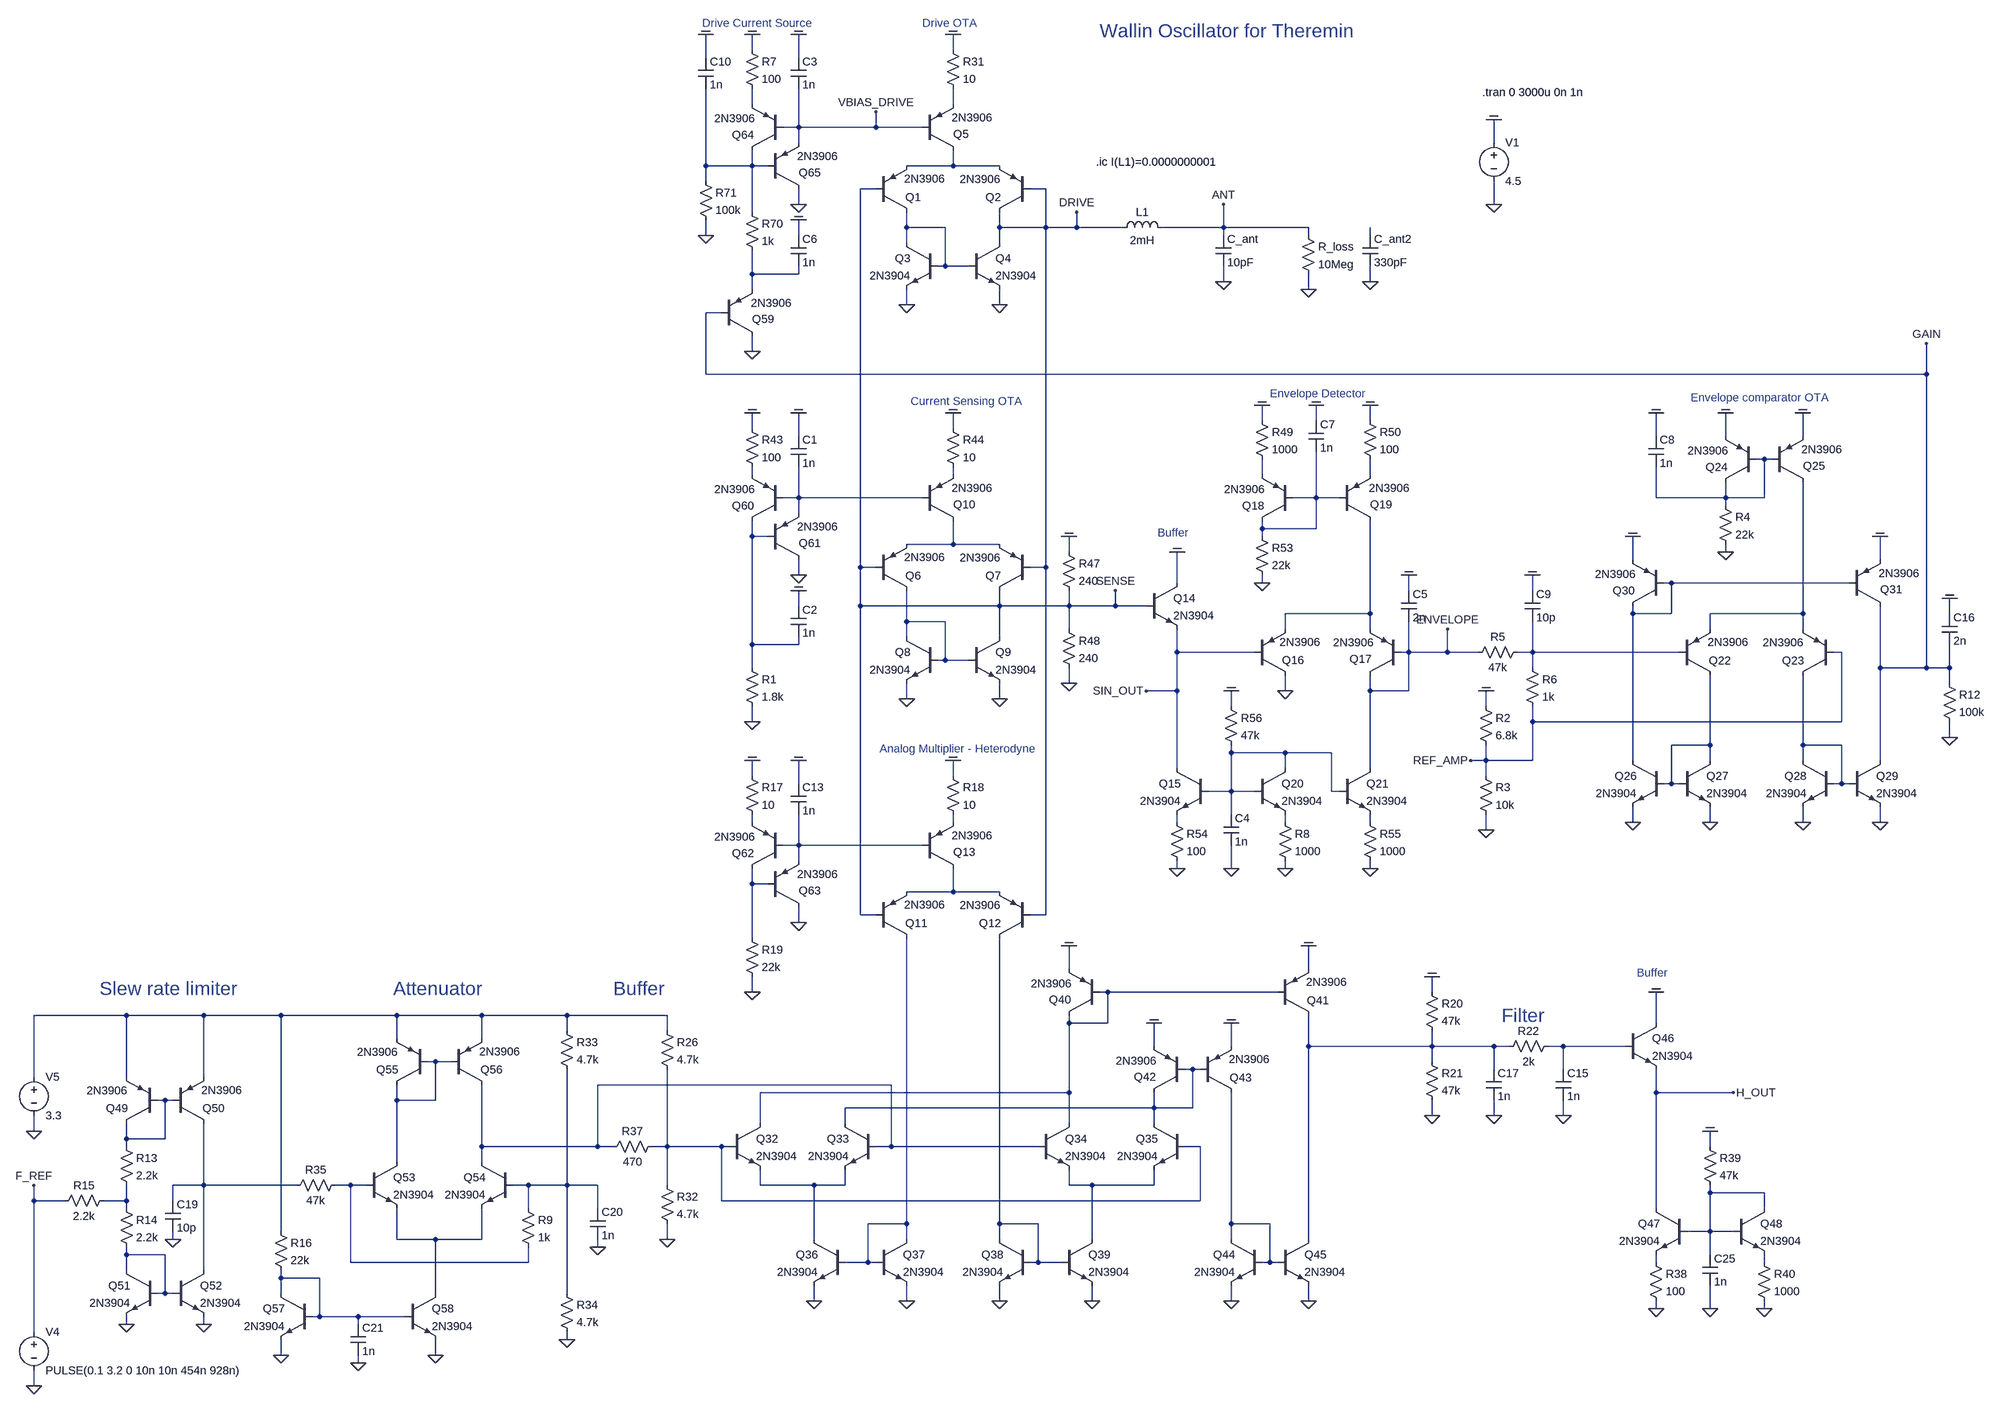
[diagram p0: schematic current_sensing_osc_v14.asc]
current_sensing_osc_v14.asc, the LTspice schematic file:
Version 4
SHEET 1 20072 11696
WIRE 15840 8208 15840 8176
WIRE 16256 8208 16256 8176
WIRE 15744 8224 15744 8176
WIRE 15936 8224 15936 8176
WIRE 15840 8320 15840 8288
WIRE 16256 8320 16256 8288
WIRE 15936 8368 15936 8288
WIRE 15936 8368 15904 8368
WIRE 16096 8368 16096 8336
WIRE 16096 8368 15936 8368
WIRE 16192 8368 16096 8368
WIRE 15936 8400 15936 8368
WIRE 17376 8400 17376 8352
WIRE 15744 8448 15744 8288
WIRE 15840 8448 15840 8416
WIRE 15840 8448 15744 8448
WIRE 15872 8448 15840 8448
WIRE 16256 8448 16256 8416
WIRE 16256 8448 16160 8448
WIRE 16352 8448 16256 8448
WIRE 15744 8480 15744 8448
WIRE 16096 8496 16064 8496
WIRE 16448 8496 16416 8496
WIRE 15936 8528 15936 8496
WIRE 17376 8528 17376 8480
WIRE 15840 8544 15840 8448
WIRE 16160 8576 16160 8544
WIRE 16240 8576 16160 8576
WIRE 16352 8576 16352 8544
WIRE 16448 8576 16448 8496
WIRE 16448 8576 16352 8576
WIRE 16512 8576 16512 8544
WIRE 16512 8576 16448 8576
WIRE 16608 8576 16512 8576
WIRE 16816 8576 16816 8528
WIRE 16816 8576 16688 8576
WIRE 16992 8576 16816 8576
WIRE 15744 8592 15744 8560
WIRE 15936 8592 15936 8560
WIRE 16816 8592 16816 8576
WIRE 16992 8592 16992 8576
WIRE 17120 8592 17120 8576
WIRE 16160 8608 16160 8576
WIRE 16352 8608 16352 8576
WIRE 16240 8656 16240 8576
WIRE 16240 8656 16224 8656
WIRE 16288 8656 16240 8656
WIRE 15840 8672 15840 8624
WIRE 15936 8672 15936 8656
WIRE 15936 8672 15840 8672
WIRE 16816 8688 16816 8656
WIRE 17120 8688 17120 8656
WIRE 15840 8704 15840 8672
WIRE 16992 8704 16992 8672
WIRE 16160 8736 16160 8704
WIRE 16352 8736 16352 8704
WIRE 15776 8752 15744 8752
WIRE 15840 8832 15840 8800
WIRE 15744 8880 15744 8752
WIRE 18272 8880 18272 8816
WIRE 18272 8880 15744 8880
WIRE 16896 8976 16896 8944
WIRE 17008 8976 17008 8944
WIRE 17120 8976 17120 8944
WIRE 15840 8992 15840 8960
WIRE 16256 8992 16256 8960
WIRE 15936 9008 15936 8960
WIRE 17712 9008 17712 8960
WIRE 17856 9008 17856 8960
WIRE 18016 9008 18016 8960
WIRE 17936 9056 17920 9056
WIRE 17952 9056 17936 9056
WIRE 15840 9088 15840 9072
WIRE 16256 9088 16256 9072
WIRE 16896 9088 16896 9056
WIRE 17120 9088 17120 9056
WIRE 15936 9136 15936 9072
WIRE 15936 9136 15904 9136
WIRE 16192 9136 15936 9136
WIRE 17008 9136 17008 9040
WIRE 17008 9136 16960 9136
WIRE 17056 9136 17008 9136
WIRE 17712 9136 17712 9072
WIRE 17856 9136 17856 9104
WIRE 17856 9136 17712 9136
WIRE 17936 9136 17936 9056
WIRE 17936 9136 17856 9136
WIRE 17856 9152 17856 9136
WIRE 15936 9168 15936 9136
WIRE 16896 9200 16896 9184
WIRE 17008 9200 17008 9136
WIRE 17008 9200 16896 9200
WIRE 15840 9216 15840 9184
WIRE 15872 9216 15840 9216
WIRE 16896 9216 16896 9200
WIRE 16256 9232 16256 9184
WIRE 16256 9232 16160 9232
WIRE 16352 9232 16256 9232
WIRE 16496 9248 16496 9216
WIRE 17856 9248 17856 9232
WIRE 17664 9264 17664 9216
WIRE 18176 9264 18176 9216
WIRE 16064 9280 16064 8496
WIRE 16096 9280 16064 9280
WIRE 16448 9280 16448 8576
WIRE 16448 9280 16416 9280
WIRE 15936 9296 15936 9264
WIRE 16720 9312 16720 9248
WIRE 16896 9312 16896 9296
WIRE 17744 9312 17728 9312
WIRE 18112 9312 17744 9312
WIRE 17200 9328 17200 9296
WIRE 17456 9328 17456 9296
WIRE 15936 9360 15936 9328
WIRE 16064 9360 16064 9280
WIRE 16352 9360 16352 9328
WIRE 16352 9360 16064 9360
WIRE 16496 9360 16496 9328
WIRE 16496 9360 16352 9360
WIRE 16592 9360 16592 9328
WIRE 16592 9360 16496 9360
WIRE 16656 9360 16592 9360
WIRE 17120 9376 17120 9184
WIRE 17120 9376 16944 9376
WIRE 17664 9376 17664 9360
WIRE 17744 9376 17744 9312
WIRE 17744 9376 17664 9376
WIRE 18016 9376 18016 9104
WIRE 18016 9376 17824 9376
WIRE 18320 9376 18320 9344
WIRE 16160 9392 16160 9328
WIRE 16240 9392 16160 9392
WIRE 16496 9408 16496 9360
WIRE 16944 9408 16944 9376
WIRE 17120 9408 17120 9376
WIRE 17824 9408 17824 9376
WIRE 18016 9408 18016 9376
WIRE 16160 9424 16160 9392
WIRE 16352 9424 16352 9360
WIRE 15840 9440 15840 9216
WIRE 15936 9440 15936 9424
WIRE 15936 9440 15840 9440
WIRE 16720 9456 16720 9408
WIRE 16880 9456 16720 9456
WIRE 17200 9456 17200 9392
WIRE 17200 9456 17184 9456
WIRE 17280 9456 17280 9408
WIRE 17280 9456 17200 9456
WIRE 17344 9456 17280 9456
WIRE 17456 9456 17456 9392
WIRE 17456 9456 17424 9456
WIRE 17760 9456 17456 9456
WIRE 18096 9456 18080 9456
WIRE 16240 9472 16240 9392
WIRE 16240 9472 16224 9472
WIRE 16288 9472 16240 9472
WIRE 15840 9488 15840 9440
WIRE 17456 9488 17456 9456
WIRE 18176 9488 18176 9360
WIRE 18272 9488 18272 8880
WIRE 18272 9488 18176 9488
WIRE 18320 9488 18320 9440
WIRE 18320 9488 18272 9488
WIRE 16496 9520 16496 9488
WIRE 18320 9520 18320 9488
WIRE 16720 9536 16720 9456
WIRE 16720 9536 16656 9536
WIRE 16944 9536 16944 9504
WIRE 17120 9536 17120 9504
WIRE 17200 9536 17200 9456
WIRE 17200 9536 17120 9536
WIRE 16160 9552 16160 9520
WIRE 16352 9552 16352 9520
WIRE 16832 9568 16832 9536
WIRE 17360 9568 17360 9536
WIRE 15840 9600 15840 9568
WIRE 17456 9600 17456 9568
WIRE 18096 9600 18096 9456
WIRE 18096 9600 17456 9600
WIRE 18320 9632 18320 9600
WIRE 17824 9648 17824 9504
WIRE 17824 9648 17744 9648
WIRE 18016 9648 18016 9504
WIRE 18096 9648 18016 9648
WIRE 16832 9664 16832 9648
WIRE 16944 9664 16832 9664
WIRE 17040 9664 16944 9664
WIRE 17360 9680 17360 9648
WIRE 17360 9680 17328 9680
WIRE 17456 9680 17456 9600
WIRE 17456 9680 17360 9680
WIRE 17664 9680 17664 9376
WIRE 17824 9680 17824 9648
WIRE 18016 9680 18016 9648
WIRE 18176 9680 18176 9488
WIRE 16720 9696 16720 9536
WIRE 16944 9696 16944 9664
WIRE 17120 9696 17120 9536
WIRE 15840 9712 15840 9680
WIRE 16256 9712 16256 9680
WIRE 17360 9712 17360 9680
WIRE 15936 9728 15936 9680
WIRE 17744 9728 17744 9648
WIRE 17744 9728 17728 9728
WIRE 17760 9728 17744 9728
WIRE 18096 9728 18096 9648
WIRE 18096 9728 18080 9728
WIRE 18112 9728 18096 9728
WIRE 16832 9744 16832 9664
WIRE 16832 9744 16784 9744
WIRE 16880 9744 16832 9744
WIRE 17040 9744 17040 9664
WIRE 17056 9744 17040 9744
WIRE 16832 9792 16832 9744
WIRE 15840 9808 15840 9792
WIRE 16256 9808 16256 9792
WIRE 16720 9808 16720 9792
WIRE 16944 9808 16944 9792
WIRE 17120 9808 17120 9792
WIRE 17664 9808 17664 9776
WIRE 17824 9808 17824 9776
WIRE 18016 9808 18016 9776
WIRE 18176 9808 18176 9776
WIRE 17360 9824 17360 9792
WIRE 15936 9856 15936 9792
WIRE 15936 9856 15904 9856
WIRE 16192 9856 15936 9856
WIRE 15936 9888 15936 9856
WIRE 16720 9904 16720 9888
WIRE 16832 9904 16832 9856
WIRE 16944 9904 16944 9888
WIRE 17120 9904 17120 9888
WIRE 15840 9936 15840 9904
WIRE 15872 9936 15840 9936
WIRE 16256 9952 16256 9904
WIRE 16256 9952 16160 9952
WIRE 16352 9952 16256 9952
WIRE 16064 10000 16064 9360
WIRE 16096 10000 16064 10000
WIRE 16448 10000 16448 9280
WIRE 16448 10000 16416 10000
WIRE 15936 10016 15936 9984
WIRE 15840 10048 15840 9936
WIRE 16496 10112 16496 10064
WIRE 16992 10112 16992 10064
WIRE 15840 10160 15840 10128
WIRE 16576 10160 16560 10160
WIRE 16928 10160 16576 10160
WIRE 17248 10160 17248 10128
WIRE 14544 10208 14352 10208
WIRE 14704 10208 14544 10208
WIRE 14864 10208 14704 10208
WIRE 15104 10208 14864 10208
WIRE 15280 10208 15104 10208
WIRE 15456 10208 15280 10208
WIRE 15664 10208 15456 10208
WIRE 16496 10224 16496 10208
WIRE 16576 10224 16576 10160
WIRE 16576 10224 16496 10224
WIRE 17712 10224 17712 10160
WIRE 15456 10240 15456 10208
WIRE 15664 10240 15664 10208
WIRE 15104 10256 15104 10208
WIRE 15280 10256 15280 10208
WIRE 16672 10272 16672 10224
WIRE 16832 10272 16832 10224
WIRE 16992 10272 16992 10208
WIRE 17248 10272 17248 10240
WIRE 17248 10272 16992 10272
WIRE 17376 10272 17248 10272
WIRE 17408 10272 17376 10272
WIRE 17520 10272 17488 10272
WIRE 17648 10272 17520 10272
WIRE 15184 10304 15168 10304
WIRE 15216 10304 15184 10304
WIRE 17248 10304 17248 10272
WIRE 16752 10320 16736 10320
WIRE 16768 10320 16752 10320
WIRE 17376 10320 17376 10272
WIRE 17520 10320 17520 10272
WIRE 14352 10336 14352 10208
WIRE 14544 10336 14544 10208
WIRE 14704 10336 14704 10208
WIRE 16128 10352 15520 10352
WIRE 16496 10368 16496 10224
WIRE 16496 10368 15856 10368
WIRE 17712 10368 17712 10320
WIRE 17872 10368 17712 10368
WIRE 14624 10384 14608 10384
WIRE 14640 10384 14624 10384
WIRE 15104 10384 15104 10352
WIRE 15184 10384 15184 10304
WIRE 15184 10384 15104 10384
WIRE 16672 10400 16672 10368
WIRE 16672 10400 16032 10400
WIRE 16752 10400 16752 10320
WIRE 16752 10400 16672 10400
WIRE 17248 10416 17248 10384
WIRE 17376 10416 17376 10384
WIRE 17520 10416 17520 10384
WIRE 15856 10432 15856 10368
WIRE 16032 10432 16032 10400
WIRE 16496 10432 16496 10368
WIRE 16672 10432 16672 10400
WIRE 14352 10448 14352 10416
WIRE 14544 10464 14544 10432
WIRE 14624 10464 14624 10384
WIRE 14624 10464 14544 10464
WIRE 14544 10480 14544 10464
WIRE 15280 10480 15280 10352
WIRE 15520 10480 15520 10352
WIRE 15520 10480 15280 10480
WIRE 15552 10480 15520 10480
WIRE 15664 10480 15664 10320
WIRE 15664 10480 15632 10480
WIRE 15776 10480 15664 10480
WIRE 15792 10480 15776 10480
WIRE 16128 10480 16128 10352
WIRE 16128 10480 16096 10480
WIRE 16432 10480 16128 10480
WIRE 16768 10480 16736 10480
WIRE 17824 10480 17824 10448
WIRE 15104 10512 15104 10384
WIRE 15280 10512 15280 10480
WIRE 14704 10560 14704 10432
WIRE 14704 10560 14640 10560
WIRE 14896 10560 14704 10560
WIRE 15008 10560 14976 10560
WIRE 15040 10560 15008 10560
WIRE 15376 10560 15344 10560
WIRE 15456 10560 15456 10320
WIRE 15456 10560 15376 10560
WIRE 15520 10560 15456 10560
WIRE 15664 10560 15664 10480
WIRE 15856 10560 15856 10528
WIRE 15968 10560 15856 10560
WIRE 16032 10560 16032 10528
WIRE 16032 10560 15968 10560
WIRE 16496 10560 16496 10528
WIRE 16544 10560 16496 10560
WIRE 16672 10560 16672 10528
WIRE 16672 10560 16544 10560
WIRE 17824 10576 17824 10560
WIRE 17936 10576 17824 10576
WIRE 14352 10592 14352 10560
WIRE 14416 10592 14352 10592
WIRE 14544 10592 14544 10560
WIRE 14544 10592 14496 10592
WIRE 14640 10592 14640 10560
WIRE 15776 10592 15776 10480
WIRE 16768 10592 16768 10480
WIRE 16768 10592 15776 10592
WIRE 14544 10608 14544 10592
WIRE 15376 10608 15376 10560
WIRE 15520 10608 15520 10560
WIRE 17712 10608 17712 10368
WIRE 17936 10608 17936 10576
WIRE 16160 10640 16160 10048
WIRE 16160 10640 16080 10640
WIRE 16352 10640 16352 10048
WIRE 16432 10640 16352 10640
WIRE 16832 10640 16832 10368
WIRE 16912 10640 16832 10640
WIRE 14864 10656 14864 10208
WIRE 17824 10656 17824 10576
WIRE 17824 10656 17776 10656
WIRE 17872 10656 17824 10656
WIRE 14640 10672 14640 10656
WIRE 15104 10672 15104 10608
WIRE 15184 10672 15104 10672
WIRE 15280 10672 15280 10608
WIRE 15280 10672 15184 10672
WIRE 15664 10672 15664 10640
WIRE 15968 10672 15968 10560
WIRE 16160 10672 16160 10640
WIRE 16352 10672 16352 10640
WIRE 16544 10672 16544 10560
WIRE 16832 10672 16832 10640
WIRE 16992 10672 16992 10272
WIRE 15520 10688 15520 10672
WIRE 14544 10704 14544 10688
WIRE 14624 10704 14544 10704
WIRE 17824 10704 17824 10656
WIRE 15008 10720 15008 10560
WIRE 15376 10720 15376 10688
WIRE 15376 10720 15008 10720
WIRE 16080 10720 16080 10640
WIRE 16080 10720 16032 10720
WIRE 16096 10720 16080 10720
WIRE 16432 10720 16432 10640
WIRE 16432 10720 16416 10720
WIRE 16480 10720 16432 10720
WIRE 16912 10720 16912 10640
WIRE 16912 10720 16896 10720
WIRE 16928 10720 16912 10720
WIRE 17712 10720 17712 10704
WIRE 17936 10720 17936 10704
WIRE 14544 10736 14544 10704
WIRE 14704 10736 14704 10560
WIRE 14864 10752 14864 10736
WIRE 14944 10752 14864 10752
WIRE 14624 10784 14624 10704
WIRE 14624 10784 14608 10784
WIRE 14640 10784 14624 10784
WIRE 14864 10784 14864 10752
WIRE 15184 10784 15184 10672
WIRE 15456 10784 15456 10560
WIRE 15968 10800 15968 10768
WIRE 16160 10800 16160 10768
WIRE 16352 10800 16352 10768
WIRE 16544 10800 16544 10768
WIRE 16832 10800 16832 10768
WIRE 16992 10800 16992 10768
WIRE 17712 10816 17712 10800
WIRE 17824 10816 17824 10768
WIRE 17936 10816 17936 10800
WIRE 14944 10832 14944 10752
WIRE 14944 10832 14928 10832
WIRE 15024 10832 14944 10832
WIRE 15120 10832 15024 10832
WIRE 14544 10848 14544 10832
WIRE 14704 10848 14704 10832
WIRE 15024 10848 15024 10832
WIRE 14352 10864 14352 10592
WIRE 15456 10880 15456 10864
WIRE 14864 10912 14864 10880
WIRE 15184 10912 15184 10880
WIRE 15024 10928 15024 10912
WIRE 14352 10976 14352 10944
FLAG 17376 8528 0
FLAG 17376 8352 COM
FLAG 15840 8176 COM
FLAG 16256 8176 COM
FLAG 16160 8736 0
FLAG 16352 8736 0
FLAG 16816 8688 0
FLAG 16816 8528 ANT
FLAG 15840 8960 COM
FLAG 16256 8960 COM
FLAG 16160 9552 0
FLAG 16352 9552 0
FLAG 15840 9600 0
FLAG 16496 9216 COM
FLAG 16496 9520 0
FLAG 16896 8944 COM
FLAG 17120 8944 COM
FLAG 16944 9536 0
FLAG 16896 9312 0
FLAG 16720 9904 0
FLAG 17120 9904 0
FLAG 16832 9536 COM
FLAG 18016 8960 COM
FLAG 18176 9808 0
FLAG 15840 8832 0
FLAG 15744 8592 0
FLAG 17856 8960 COM
FLAG 17856 9248 0
FLAG 18016 9808 0
FLAG 16944 9904 0
FLAG 16720 9248 COM
FLAG 17824 9808 0
FLAG 17664 9808 0
FLAG 18176 9216 COM
FLAG 17664 9216 COM
FLAG 18320 9344 COM
FLAG 18320 9632 0
FLAG 18272 8816 GAIN
FLAG 16592 9328 SENSE
FLAG 16512 8544 DRIVE
FLAG 15936 8960 COM
FLAG 15936 8176 COM
FLAG 17200 9296 COM
FLAG 15936 8560 COM
FLAG 17008 8944 COM
FLAG 17712 8960 COM
FLAG 17120 8688 0
FLAG 17360 9536 COM
FLAG 17360 9824 0
FLAG 17456 9296 COM
FLAG 16992 8704 0
FLAG 15936 8528 0
FLAG 15936 9296 0
FLAG 15936 9328 COM
FLAG 15744 8176 COM
FLAG 17328 9680 REF_AMP
FLAG 17280 9408 ENVELOPE
FLAG 16656 9536 SIN_OUT
FLAG 16832 9904 0
FLAG 15840 9680 COM
FLAG 16256 9680 COM
FLAG 16352 10800 0
FLAG 16544 10800 0
FLAG 15840 10160 0
FLAG 15936 9680 COM
FLAG 15936 10016 0
FLAG 15968 10800 0
FLAG 16160 10800 0
FLAG 16496 10064 COM
FLAG 16672 10224 COM
FLAG 16992 10064 COM
FLAG 16832 10224 COM
FLAG 16832 10800 0
FLAG 16992 10800 0
FLAG 17248 10128 COM
FLAG 17248 10416 0
FLAG 17520 10416 0
FLAG 17376 10416 0
FLAG 14352 10976 0
FLAG 14352 10448 0
FLAG 14544 10848 0
FLAG 14704 10848 0
FLAG 14640 10672 0
FLAG 14864 10912 0
FLAG 15184 10912 0
FLAG 15456 10880 0
FLAG 15520 10688 0
FLAG 15024 10928 0
FLAG 15664 10672 0
FLAG 17712 10816 0
FLAG 17824 10448 COM
FLAG 17712 10160 COM
FLAG 17872 10368 H_OUT
FLAG 17936 10816 0
FLAG 17824 10816 0
FLAG 14352 10560 F_REF
FLAG 16096 8336 VBIAS_DRIVE
SYMBOL voltage 17376 8384 R0
SYMATTR InstName V1
SYMATTR Value 4.5
SYMBOL pnp 15904 8416 R180
WINDOW 0 60 32 Left 2
WINDOW 3 58 66 Left 2
SYMATTR InstName Q64
SYMATTR Value 2N3906
SYMBOL Res 15824 8192 R0
SYMATTR InstName R7
SYMATTR Value 100
SYMBOL pnp 16192 8416 M180
WINDOW 0 64 34 Left 2
WINDOW 3 61 68 Left 2
SYMATTR InstName Q5
SYMATTR Value 2N3906
SYMBOL Res 16240 8192 R0
SYMATTR InstName R31
SYMATTR Value 10
SYMBOL pnp 16416 8544 R180
WINDOW 0 61 31 Left 2
WINDOW 3 62 68 Left 2
SYMATTR InstName Q2
SYMATTR Value 2N3906
SYMBOL pnp 16096 8544 M180
WINDOW 0 61 31 Left 2
WINDOW 3 59 69 Left 2
SYMATTR InstName Q1
SYMATTR Value 2N3906
SYMBOL npn 16224 8608 M0
SYMATTR InstName Q3
SYMATTR Value 2N3904
SYMBOL npn 16288 8608 R0
SYMATTR InstName Q4
SYMATTR Value 2N3904
SYMBOL ind 16592 8592 R270
WINDOW 0 32 56 VTop 2
WINDOW 3 5 56 VBottom 2
SYMATTR InstName L1
SYMATTR Value 2mH
SYMATTR SpiceLine Rser=120 Cpar=1pF
SYMBOL Cap 16800 8592 R0
SYMATTR InstName C_ant
SYMATTR Value 10pF
SYMBOL pnp 15904 9184 R180
WINDOW 0 60 32 Left 2
WINDOW 3 58 66 Left 2
SYMATTR InstName Q60
SYMATTR Value 2N3906
SYMBOL Res 15824 8976 R0
SYMATTR InstName R43
SYMATTR Value 100
SYMBOL pnp 16192 9184 M180
WINDOW 0 64 34 Left 2
WINDOW 3 61 68 Left 2
SYMATTR InstName Q10
SYMATTR Value 2N3906
SYMBOL Res 16240 8976 R0
SYMATTR InstName R44
SYMATTR Value 10
SYMBOL pnp 16416 9328 R180
WINDOW 0 61 31 Left 2
WINDOW 3 62 68 Left 2
SYMATTR InstName Q7
SYMATTR Value 2N3906
SYMBOL pnp 16096 9328 M180
WINDOW 0 61 31 Left 2
WINDOW 3 59 69 Left 2
SYMATTR InstName Q6
SYMATTR Value 2N3906
SYMBOL npn 16224 9424 M0
SYMATTR InstName Q8
SYMATTR Value 2N3904
SYMBOL npn 16288 9424 R0
SYMATTR InstName Q9
SYMATTR Value 2N3904
SYMBOL Res 16480 9232 R0
SYMATTR InstName R47
SYMATTR Value 240
SYMBOL Res 16480 9392 R0
SYMATTR InstName R48
SYMATTR Value 240
SYMBOL pnp 16960 9184 R180
WINDOW 0 60 32 Left 2
WINDOW 3 58 66 Left 2
SYMATTR InstName Q18
SYMATTR Value 2N3906
SYMBOL Res 16880 8960 R0
SYMATTR InstName R49
SYMATTR Value 1000
SYMBOL pnp 17056 9184 M180
WINDOW 0 64 34 Left 2
WINDOW 3 61 68 Left 2
SYMATTR InstName Q19
SYMATTR Value 2N3906
SYMBOL Res 17104 8960 R0
SYMATTR InstName R50
SYMATTR Value 100
SYMBOL pnp 17184 9504 R180
WINDOW 0 61 34 Left 2
WINDOW 3 56 68 Left 2
SYMATTR InstName Q17
SYMATTR Value 2N3906
SYMBOL pnp 16880 9504 M180
WINDOW 0 57 32 Left 2
WINDOW 3 52 69 Left 2
SYMATTR InstName Q16
SYMATTR Value 2N3906
SYMBOL Res 16880 9200 R0
SYMATTR InstName R53
SYMATTR Value 22k
SYMBOL npn 16784 9696 M0
SYMATTR InstName Q15
SYMATTR Value 2N3904
SYMBOL Res 16704 9792 R0
SYMATTR InstName R54
SYMATTR Value 100
SYMBOL npn 17056 9696 R0
SYMATTR InstName Q21
SYMATTR Value 2N3904
SYMBOL Res 17104 9792 R0
SYMATTR InstName R55
SYMATTR Value 1000
SYMBOL Res 16816 9552 R0
SYMATTR InstName R56
SYMATTR Value 47k
SYMBOL pnp 17952 9104 M180
WINDOW 0 64 34 Left 2
WINDOW 3 61 68 Left 2
SYMATTR InstName Q25
SYMATTR Value 2N3906
SYMBOL pnp 18080 9504 R180
WINDOW 0 61 31 Left 2
WINDOW 3 62 68 Left 2
SYMATTR InstName Q23
SYMATTR Value 2N3906
SYMBOL pnp 17760 9504 M180
WINDOW 0 61 31 Left 2
WINDOW 3 59 69 Left 2
SYMATTR InstName Q22
SYMATTR Value 2N3906
SYMBOL Cap 18304 9376 R0
SYMATTR InstName C16
SYMATTR Value 2n
SYMBOL npn 18112 9680 R0
SYMATTR InstName Q29
SYMATTR Value 2N3904
SYMBOL pnp 15776 8800 M180
WINDOW 0 64 34 Left 2
WINDOW 3 61 68 Left 2
SYMATTR InstName Q59
SYMATTR Value 2N3906
SYMBOL Res 15824 8528 R0
SYMATTR InstName R70
SYMATTR Value 1k
SYMBOL Res 15728 8464 R0
SYMATTR InstName R71
SYMATTR Value 100k
SYMBOL Res 15824 9472 R0
SYMATTR InstName R1
SYMATTR Value 1.8k
SYMBOL pnp 17920 9104 R180
WINDOW 0 60 32 Left 2
WINDOW 3 58 66 Left 2
SYMATTR InstName Q24
SYMATTR Value 2N3906
SYMBOL Res 17840 9136 R0
SYMATTR InstName R4
SYMATTR Value 22k
SYMBOL npn 18080 9680 M0
SYMATTR InstName Q28
SYMATTR Value 2N3904
SYMBOL npn 16880 9696 R0
SYMATTR InstName Q20
SYMATTR Value 2N3904
SYMBOL Res 16928 9792 R0
SYMATTR InstName R8
SYMATTR Value 1000
SYMBOL npn 16656 9312 R0
SYMATTR InstName Q14
SYMATTR Value 2N3904
SYMBOL npn 17760 9680 R0
SYMATTR InstName Q27
SYMATTR Value 2N3904
SYMBOL npn 17728 9680 M0
SYMATTR InstName Q26
SYMATTR Value 2N3904
SYMBOL pnp 18112 9360 M180
WINDOW 0 64 34 Left 2
WINDOW 3 61 68 Left 2
SYMATTR InstName Q31
SYMATTR Value 2N3906
SYMBOL pnp 17728 9360 R180
WINDOW 0 60 32 Left 2
WINDOW 3 58 66 Left 2
SYMATTR InstName Q30
SYMATTR Value 2N3906
SYMBOL Res 18304 9504 R0
SYMATTR InstName R12
SYMATTR Value 100k
SYMBOL Cap 15920 9008 R0
SYMATTR InstName C1
SYMATTR Value 1n
SYMBOL Cap 15920 8224 R0
SYMATTR InstName C3
SYMATTR Value 1n
SYMBOL Cap 17184 9328 R0
SYMATTR InstName C5
SYMATTR Value 2n
SYMBOL Cap 16816 9792 R0
SYMATTR InstName C4
SYMATTR Value 1n
SYMBOL Cap 15920 8592 R0
SYMATTR InstName C6
SYMATTR Value 1n
SYMBOL Cap 16992 8976 R0
SYMATTR InstName C7
SYMATTR Value 1n
SYMBOL Cap 17696 9008 R0
SYMATTR InstName C8
SYMATTR Value 1n
SYMBOL Cap 17104 8592 R0
SYMATTR InstName C_ant2
SYMATTR Value 330pF
SYMBOL Res 17344 9552 R0
SYMATTR InstName R2
SYMATTR Value 6.8k
SYMBOL Res 17344 9696 R0
SYMATTR InstName R3
SYMATTR Value 10k
SYMBOL Res 17440 9440 R90
WINDOW 0 0 56 VBottom 2
WINDOW 3 32 56 VTop 2
SYMATTR InstName R5
SYMATTR Value 47k
SYMBOL Res 17440 9472 R0
SYMATTR InstName R6
SYMATTR Value 1k
SYMBOL Cap 17440 9328 R0
SYMATTR InstName C9
SYMATTR Value 10p
SYMBOL Res 16976 8576 R0
SYMATTR InstName R_loss
SYMATTR Value 10Meg
SYMBOL pnp 15872 8496 M180
WINDOW 0 64 34 Left 2
WINDOW 3 61 68 Left 2
SYMATTR InstName Q65
SYMATTR Value 2N3906
SYMBOL pnp 15872 9264 M180
WINDOW 0 64 34 Left 2
WINDOW 3 61 68 Left 2
SYMATTR InstName Q61
SYMATTR Value 2N3906
SYMBOL Cap 15920 9360 R0
SYMATTR InstName C2
SYMATTR Value 1n
SYMBOL Cap 15728 8224 R0
SYMATTR InstName C10
SYMATTR Value 1n
SYMBOL pnp 15904 9904 R180
WINDOW 0 60 32 Left 2
WINDOW 3 58 66 Left 2
SYMATTR InstName Q62
SYMATTR Value 2N3906
SYMBOL Res 15824 9696 R0
SYMATTR InstName R17
SYMATTR Value 10
SYMBOL pnp 16192 9904 M180
WINDOW 0 64 34 Left 2
WINDOW 3 61 68 Left 2
SYMATTR InstName Q13
SYMATTR Value 2N3906
SYMBOL Res 16240 9696 R0
SYMATTR InstName R18
SYMATTR Value 10
SYMBOL pnp 16416 10048 R180
WINDOW 0 61 31 Left 2
WINDOW 3 62 68 Left 2
SYMATTR InstName Q12
SYMATTR Value 2N3906
SYMBOL pnp 16096 10048 M180
WINDOW 0 61 31 Left 2
WINDOW 3 59 69 Left 2
SYMATTR InstName Q11
SYMATTR Value 2N3906
SYMBOL npn 16416 10672 M0
SYMATTR InstName Q38
SYMATTR Value 2N3904
SYMBOL npn 16480 10672 R0
SYMATTR InstName Q39
SYMATTR Value 2N3904
SYMBOL Res 15824 10032 R0
SYMATTR InstName R19
SYMATTR Value 22k
SYMBOL Cap 15920 9728 R0
SYMATTR InstName C13
SYMATTR Value 1n
SYMBOL pnp 15872 9984 M180
WINDOW 0 64 34 Left 2
WINDOW 3 61 68 Left 2
SYMATTR InstName Q63
SYMATTR Value 2N3906
SYMBOL npn 16032 10672 M0
SYMATTR InstName Q36
SYMATTR Value 2N3904
SYMBOL npn 16096 10672 R0
SYMATTR InstName Q37
SYMATTR Value 2N3904
SYMBOL npn 16096 10432 M0
SYMATTR InstName Q33
SYMATTR Value 2N3904
SYMBOL npn 15792 10432 R0
SYMATTR InstName Q32
SYMATTR Value 2N3904
SYMBOL npn 16736 10432 M0
SYMATTR InstName Q35
SYMATTR Value 2N3904
SYMBOL npn 16432 10432 R0
SYMATTR InstName Q34
SYMATTR Value 2N3904
SYMBOL pnp 16560 10208 R180
WINDOW 0 60 32 Left 2
WINDOW 3 58 66 Left 2
SYMATTR InstName Q40
SYMATTR Value 2N3906
SYMBOL pnp 16736 10368 R180
WINDOW 0 60 32 Left 2
WINDOW 3 58 66 Left 2
SYMATTR InstName Q42
SYMATTR Value 2N3906
SYMBOL pnp 16928 10208 M180
WINDOW 0 61 31 Left 2
WINDOW 3 59 69 Left 2
SYMATTR InstName Q41
SYMATTR Value 2N3906
SYMBOL pnp 16768 10368 M180
WINDOW 0 61 31 Left 2
WINDOW 3 59 69 Left 2
SYMATTR InstName Q43
SYMATTR Value 2N3906
SYMBOL npn 16896 10672 M0
SYMATTR InstName Q44
SYMATTR Value 2N3904
SYMBOL npn 16928 10672 R0
SYMATTR InstName Q45
SYMATTR Value 2N3904
SYMBOL Res 17232 10144 R0
SYMATTR InstName R20
SYMATTR Value 47k
SYMBOL Res 17232 10288 R0
SYMATTR InstName R21
SYMATTR Value 47k
SYMBOL Cap 17504 10320 R0
SYMATTR InstName C15
SYMATTR Value 1n
SYMBOL Cap 17360 10320 R0
SYMATTR InstName C17
SYMATTR Value 1n
SYMBOL Res 17504 10256 R90
WINDOW 0 0 56 VBottom 2
WINDOW 3 32 56 VTop 2
SYMATTR InstName R22
SYMATTR Value 2k
SYMBOL voltage 14352 10848 R0
SYMATTR InstName V4
SYMATTR Value PULSE(0.1 3.2 0 10n 10n 454n 928n)
SYMBOL Voltage 14352 10320 R0
SYMATTR InstName V5
SYMATTR Value 3.3
SYMBOL pnp 14640 10432 M180
WINDOW 0 61 31 Left 2
WINDOW 3 59 69 Left 2
SYMATTR InstName Q50
SYMATTR Value 2N3906
SYMBOL pnp 14608 10432 R180
WINDOW 0 61 31 Left 2
WINDOW 3 62 68 Left 2
SYMATTR InstName Q49
SYMATTR Value 2N3906
SYMBOL npn 14608 10736 M0
SYMATTR InstName Q51
SYMATTR Value 2N3904
SYMBOL npn 14640 10736 R0
SYMATTR InstName Q52
SYMATTR Value 2N3904
SYMBOL Res 14528 10464 R0
SYMATTR InstName R13
SYMATTR Value 2.2k
SYMBOL Res 14528 10592 R0
SYMATTR InstName R14
SYMATTR Value 2.2k
SYMBOL Cap 14624 10592 R0
SYMATTR InstName C19
SYMATTR Value 10p
SYMBOL Res 14512 10576 R90
WINDOW 0 0 56 VBottom 2
WINDOW 3 32 56 VTop 2
SYMATTR InstName R15
SYMATTR Value 2.2k
SYMBOL npn 14928 10784 M0
SYMATTR InstName Q57
SYMATTR Value 2N3904
SYMBOL npn 15120 10784 R0
SYMATTR InstName Q58
SYMATTR Value 2N3904
SYMBOL npn 15344 10512 M0
SYMATTR InstName Q54
SYMATTR Value 2N3904
SYMBOL npn 15040 10512 R0
SYMATTR InstName Q53
SYMATTR Value 2N3904
SYMBOL Res 14848 10640 R0
SYMATTR InstName R16
SYMATTR Value 22k
SYMBOL Res 15440 10224 R0
SYMATTR InstName R33
SYMATTR Value 4.7k
SYMBOL Res 15440 10768 R0
SYMATTR InstName R34
SYMATTR Value 4.7k
SYMBOL Res 14992 10544 R90
WINDOW 0 0 56 VBottom 2
WINDOW 3 32 56 VTop 2
SYMATTR InstName R35
SYMATTR Value 47k
SYMBOL Cap 15504 10608 R0
SYMATTR InstName C20
SYMATTR Value 1n
SYMBOL Cap 15008 10848 R0
SYMATTR InstName C21
SYMATTR Value 1n
SYMBOL pnp 15216 10352 M180
WINDOW 0 61 31 Left 2
WINDOW 3 59 69 Left 2
SYMATTR InstName Q56
SYMATTR Value 2N3906
SYMBOL pnp 15168 10352 R180
WINDOW 0 61 31 Left 2
WINDOW 3 62 68 Left 2
SYMATTR InstName Q55
SYMATTR Value 2N3906
SYMBOL Res 15648 10224 R0
SYMATTR InstName R26
SYMATTR Value 4.7k
SYMBOL Res 15648 10544 R0
SYMATTR InstName R32
SYMATTR Value 4.7k
SYMBOL Res 15648 10464 R90
WINDOW 0 0 56 VBottom 2
WINDOW 3 32 56 VTop 2
SYMATTR InstName R37
SYMATTR Value 470
SYMBOL npn 17776 10608 M0
SYMATTR InstName Q47
SYMATTR Value 2N3904
SYMBOL Res 17696 10704 R0
SYMATTR InstName R38
SYMATTR Value 100
SYMBOL Res 17808 10464 R0
SYMATTR InstName R39
SYMATTR Value 47k
SYMBOL npn 17648 10224 R0
SYMATTR InstName Q46
SYMATTR Value 2N3904
SYMBOL npn 17872 10608 R0
SYMATTR InstName Q48
SYMATTR Value 2N3904
SYMBOL Res 17920 10704 R0
SYMATTR InstName R40
SYMATTR Value 1000
SYMBOL Cap 17808 10704 R0
SYMATTR InstName C25
SYMATTR Value 1n
SYMBOL Res 15360 10592 R0
SYMATTR InstName R9
SYMATTR Value 1k
TEXT 17352 8296 Left 2 !.tran 0 3000u 0n 1n
TEXT 16552 8440 Left 2 !.ic I(L1)=0.0000000001
TEXT 16912 8920 Left 2 ;Envelope Detector
TEXT 17784 8928 Left 2 ;Envelope comparator OTA
TEXT 16680 9208 Left 2 ;Buffer
TEXT 16168 8936 Left 2 ;Current Sensing OTA
TEXT 16192 8152 Left 2 ;Drive OTA
TEXT 15736 8152 Left 2 ;Drive Current Source
TEXT 16560 8168 Left 4 ;Wallin Oscillator for Theremin
TEXT 16104 9656 Left 2 ;Analog Multiplier - Heterodyne
TEXT 17392 10208 Left 4 ;Filter
TEXT 15096 10152 Left 4 ;Attenuator
TEXT 14488 10152 Left 4 ;Slew rate limiter
TEXT 15552 10152 Left 4 ;Buffer
TEXT 17672 10120 Left 2 ;Buffer

The netlist it stands for:
* current_sensing_osc_v14.asc
V1 COM 0 4.5
Q64 N003 VBIAS_DRIVE N001 0 2N3906
R7 COM N001 100
Q5 N004 VBIAS_DRIVE N002 0 2N3906
R31 COM N002 10
Q2 DRIVE DRIVE N004 0 2N3906
Q1 N005 SENSE N004 0 2N3906
Q3 N005 N005 0 0 2N3904
Q4 DRIVE N005 0 0 2N3904
L1 DRIVE ANT 2mH Rser=120 Cpar=1pF
C_ant ANT 0 10pF
Q60 N015 N013 N009 0 2N3906
R43 COM N009 100
Q10 N016 N013 N010 0 2N3906
R44 COM N010 10
Q7 SENSE DRIVE N016 0 2N3906
Q6 N020 SENSE N016 0 2N3906
Q8 N020 N020 0 0 2N3904
Q9 SENSE N020 0 0 2N3904
R47 COM SENSE 240
R48 SENSE 0 240
Q18 N014 N014 N011 0 2N3906
R49 COM N011 1000
Q19 N018 N014 N012 0 2N3906
R50 COM N012 100
Q17 ENVELOPE ENVELOPE N018 0 2N3906
Q16 0 SIN_OUT N018 0 2N3906
R53 N014 0 22k
Q15 SIN_OUT N024 N027 0 2N3904
R54 N027 0 100
Q21 ENVELOPE N024 N029 0 2N3904
R55 N029 0 1000
R56 COM N024 47k
Q25 N019 N008 COM 0 2N3906
Q23 N023 REF_AMP N019 0 2N3906
Q22 N022 N021 N019 0 2N3906
C16 COM GAIN 2n
Q29 GAIN N023 0 0 2N3904
Q59 0 GAIN N007 0 2N3906
R70 N003 N007 1k
R71 N003 0 100k
R1 N015 0 1.8k
Q24 N008 N008 COM 0 2N3906
R4 N008 0 22k
Q28 N023 N023 0 0 2N3904
Q20 N024 N024 N028 0 2N3904
R8 N028 0 1000
Q14 COM SENSE SIN_OUT 0 2N3904
Q27 N022 N022 0 0 2N3904
Q26 N017 N022 0 0 2N3904
Q31 GAIN N017 COM 0 2N3906
Q30 N017 N017 COM 0 2N3906
R12 GAIN 0 100k
C1 COM N013 1n
C3 COM VBIAS_DRIVE 1n
C5 COM ENVELOPE 2n
C4 N024 0 1n
C6 COM N007 1n
C7 COM N014 1n
C8 COM N008 1n
C_ant2 N006 0 330pF
R2 COM REF_AMP 6.8k
R3 REF_AMP 0 10k
R5 N021 ENVELOPE 47k
R6 N021 REF_AMP 1k
C9 COM N021 10p
R_loss ANT 0 10Meg
Q65 0 N003 VBIAS_DRIVE 0 2N3906
Q61 0 N015 N013 0 2N3906
C2 COM N015 1n
C10 COM N003 1n
Q62 N031 N030 N025 0 2N3906
R17 COM N025 10
Q13 N032 N030 N026 0 2N3906
R18 COM N026 10
Q12 N050 DRIVE N032 0 2N3906
Q11 N049 SENSE N032 0 2N3906
Q38 N050 N050 0 0 2N3904
Q39 N046 N050 0 0 2N3904
R19 N031 0 22k
C13 COM N030 1n
Q63 0 N031 N030 0 2N3906
Q36 N045 N049 0 0 2N3904
Q37 N049 N049 0 0 2N3904
Q33 N038 N039 N045 0 2N3904
Q32 N033 N041 N045 0 2N3904
Q35 N038 N041 N046 0 2N3904
Q34 N033 N039 N046 0 2N3904
Q40 N033 N033 COM 0 2N3906
Q42 N038 N038 COM 0 2N3906
Q41 N035 N033 COM 0 2N3906
Q43 N051 N038 COM 0 2N3906
Q44 N051 N051 0 0 2N3904
Q45 N035 N051 0 0 2N3904
R20 COM N035 47k
R21 N035 0 47k
C15 N036 0 1n
C17 N035 0 1n
R22 N036 N035 2k
V4 F_REF 0 PULSE(0.1 3.2 0 10n 10n 454n 928n)
V5 N034 0 3.3
Q50 N042 N040 N034 0 2N3906
Q49 N040 N040 N034 0 2N3906
Q51 N053 N053 0 0 2N3904
Q52 N042 N053 0 0 2N3904
R13 N040 N048 2.2k
R14 N048 N053 2.2k
C19 N042 0 10p
R15 N048 F_REF 2.2k
Q57 N056 N056 0 0 2N3904
Q58 N052 N056 0 0 2N3904
Q54 N039 N044 N052 0 2N3904
Q53 N037 N043 N052 0 2N3904
R16 N034 N056 22k
R33 N034 N044 4.7k
R34 N044 0 4.7k
R35 N043 N042 47k
C20 N044 0 1n
C21 N056 0 1n
Q56 N039 N037 N034 0 2N3906
Q55 N037 N037 N034 0 2N3906
R26 N034 N041 4.7k
R32 N041 0 4.7k
R37 N041 N039 470
Q47 H_OUT N047 N054 0 2N3904
R38 N054 0 100
R39 COM N047 47k
Q46 COM N036 H_OUT 0 2N3904
Q48 N047 N047 N055 0 2N3904
R40 N055 0 1000
C25 N047 0 1n
R9 N044 N043 1k
.model NPN NPN
.model PNP PNP
.lib standard.bjt
.tran 0 3000u 0n 1n
.ic I(L1)=0.0000000001
* Envelope Detector
* Envelope comparator OTA
* Buffer
* Current Sensing OTA
* Drive OTA
* Drive Current Source
* Wallin Oscillator for Theremin
* Analog Multiplier - Heterodyne
* Filter
* Attenuator
* Slew rate limiter
* Buffer
* Buffer
.backanno
.end